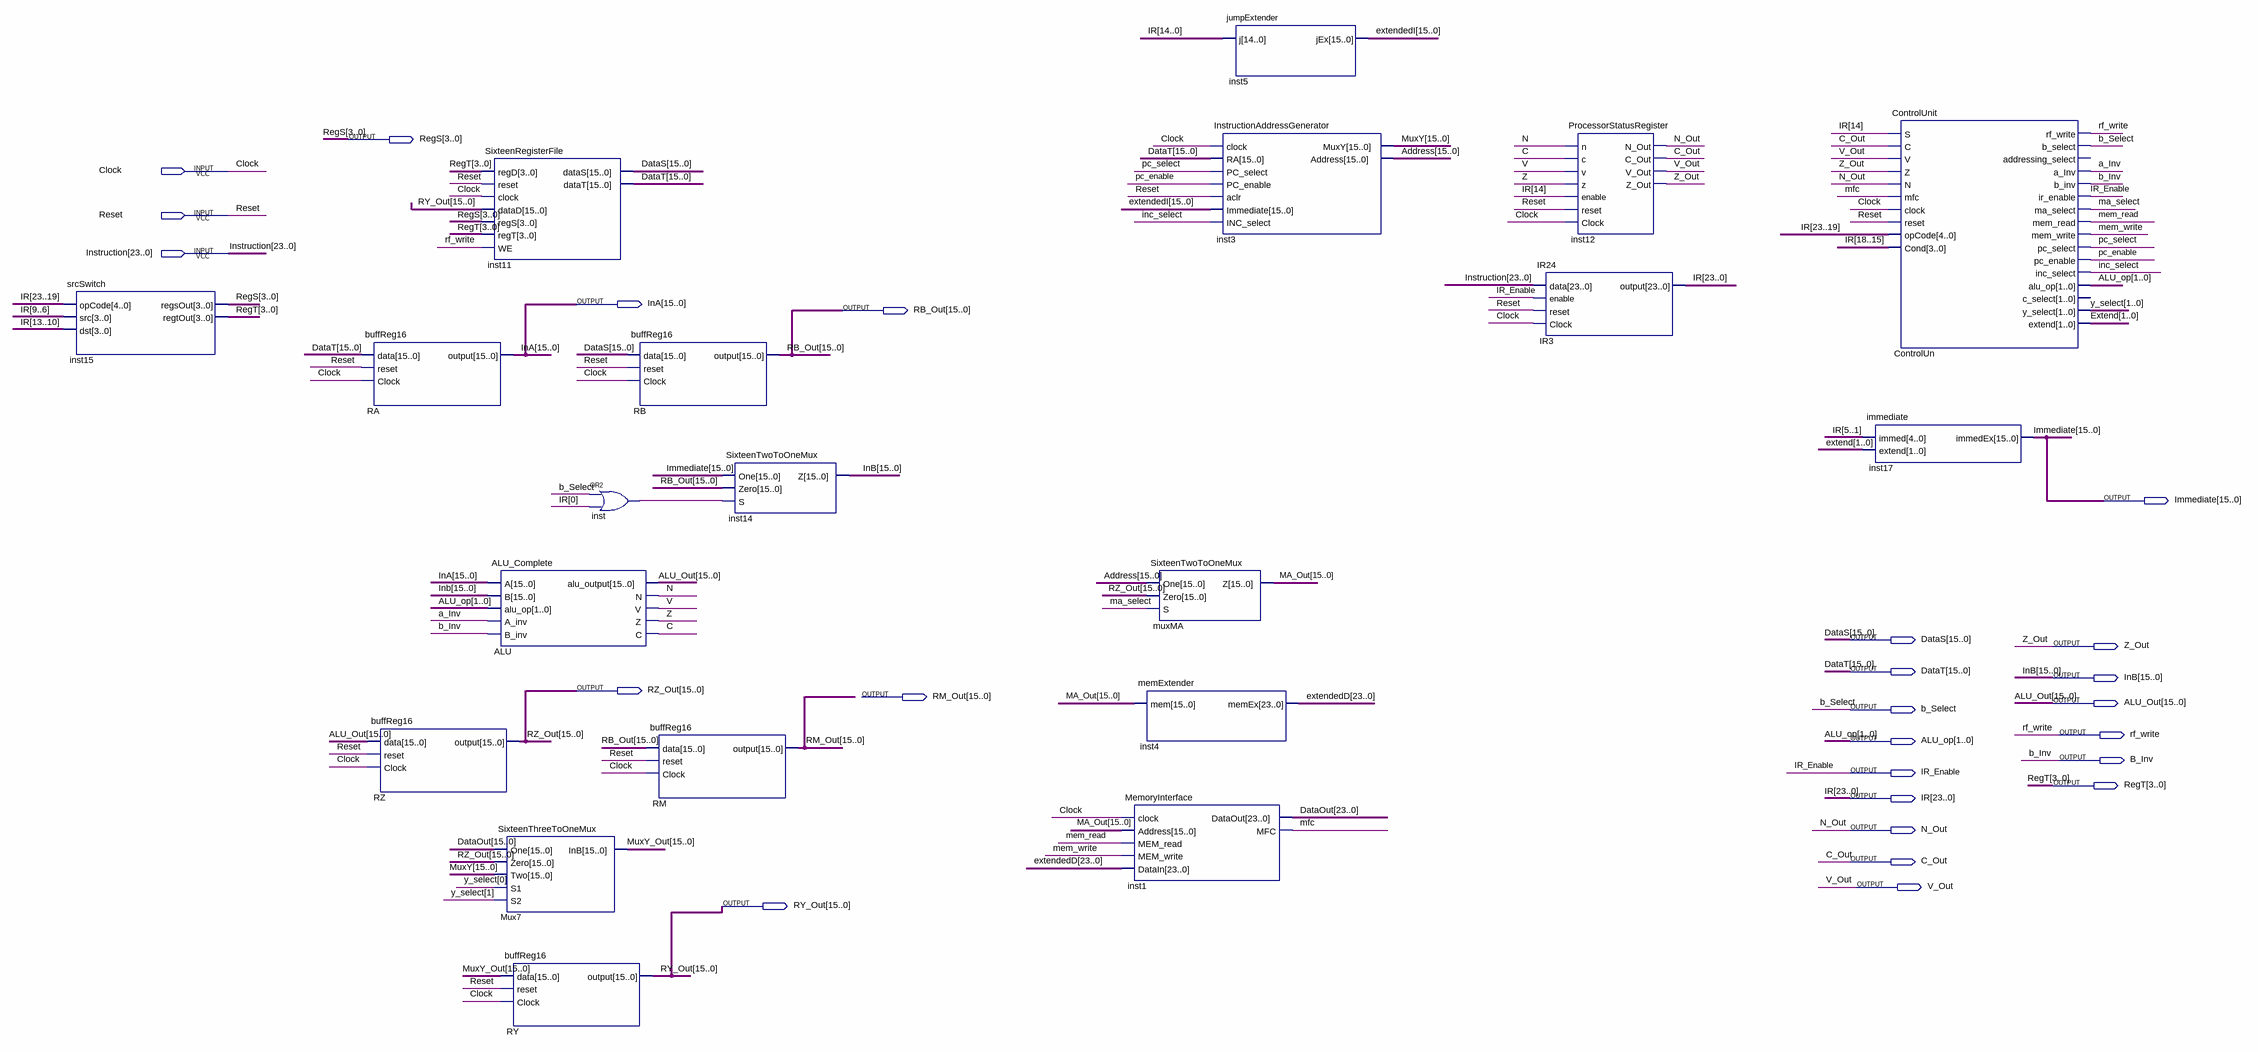
[diagram p0: schematic sheet]
// Quartus schematic Processor.bdf as structural Verilog: 20 symbols, 25 pins
module Processor (
  input  Clock,
  input  Reset,
  input  [23:0] Instruction,
  output [3:0] RegS,
  output [15:0] InA,
  output [15:0] RB_Out,
  output [15:0] Immediate,
  output [15:0] DataS,
  output Z_Out,
  output [15:0] DataT,
  output [15:0] InB,
  output [15:0] RZ_Out,
  output [15:0] RM_Out,
  output [15:0] ALU_Out,
  output b_Select,
  output rf_write,
  output [1:0] ALU_op,
  output B_Inv,
  output IR_Enable,
  output [3:0] RegT,
  output [23:0] IR,
  output N_Out,
  output C_Out,
  output V_Out,
  output [15:0] RY_Out
);

  wire a_Inv, C, inc_select, inst_out, ma_select, mem_read, mem_write, mfc, N, pc_enable, pc_select, V, Z;
  wire [1:0] Extend, y_select;
  wire [15:0] Address, extendedI, MA_Out, MuxY, MuxY_Out;
  wire [23:0] DataOut, extendedD;

  srcSwitch inst15 (.opCode(IR[23:19]), .src(IR[9:6]), .dst(IR[13:10]), .regsOut(RegS), .regtOut(RegT));
  buffReg16 RA (.data(DataT), .reset(Reset), .Clock(Clock), .\output (InA));
  buffReg16 RZ (.data(ALU_Out), .reset(Reset), .Clock(Clock), .\output (RZ_Out));
  SixteenRegisterFile inst11 (
    .regD(RegT), .reset(Reset), .clock(Clock), .dataD(RY_Out), .regS(RegS), .regT(RegT), .WE(rf_write),
    .dataS(DataS), .dataT(DataT));
  ALU_Complete ALU (
    .A(InA), .B(InB), .alu_op(ALU_op), .A_inv(a_Inv), .B_inv(B_Inv), .alu_output(ALU_Out), .N(N), .V(V),
    .Z(Z), .C(C));
  SixteenThreeToOneMux Mux7 (
    .One(DataOut[15:0]), .Zero(RZ_Out), .Two(MuxY), .S1(y_select[0]), .S2(y_select[1]), .InB(MuxY_Out));
  buffReg16 RY (.data(MuxY_Out), .reset(Reset), .Clock(Clock), .\output (RY_Out));
  or inst (inst_out, b_Select, IR[0]);
  buffReg16 RB (.data(DataS), .reset(Reset), .Clock(Clock), .\output (RB_Out));
  buffReg16 RM (.data(RB_Out), .reset(Reset), .Clock(Clock), .\output (RM_Out));
  SixteenTwoToOneMux inst14 (.One(Immediate), .Zero(RB_Out), .S(inst_out), .Z(InB));
  MemoryInterface inst1 (
    .clock(Clock), .Address(MA_Out), .MEM_read(mem_read), .MEM_write(mem_write), .DataIn(extendedD),
    .DataOut(DataOut), .MFC(mfc));
  SixteenTwoToOneMux muxMA (.One(Address), .Zero(RZ_Out), .S(ma_select), .Z(MA_Out));
  memExtender inst4 (.mem(MA_Out), .memEx(extendedD));
  jumpExtender inst5 (.j(IR[14:0]), .jEx(extendedI));
  InstructionAddressGenerator inst3 (
    .clock(Clock), .RA(DataT), .PC_select(pc_select), .PC_enable(pc_enable), .aclr(Reset),
    .Immediate(extendedI), .INC_select(inc_select), .MuxY(MuxY), .Address(Address));
  ProcessorStatusRegister inst12 (
    .n(N), .c(C), .v(V), .z(Z), .enable(IR[14]), .reset(Reset), .Clock(Clock), .N_Out(N_Out), .C_Out(C_Out),
    .V_Out(V_Out), .Z_Out(Z_Out));
  IR24 IR3 (.data(Instruction), .enable(IR_Enable), .reset(Reset), .Clock(Clock), .\output (IR));
  immediate inst17 (.immed(IR[5:1]), .extend(Extend), .immedEx(Immediate));
  ControlUnit ControlUn (
    .S(IR[14]), .C(C_Out), .V(V_Out), .Z(Z_Out), .N(N_Out), .mfc(mfc), .clock(Clock), .reset(Reset),
    .opCode(IR[23:19]), .Cond(IR[18:15]), .rf_write(rf_write), .b_select(b_Select), .a_Inv(a_Inv),
    .b_inv(B_Inv), .ir_enable(IR_Enable), .ma_select(ma_select), .mem_read(mem_read), .mem_write(mem_write),
    .pc_select(pc_select), .pc_enable(pc_enable), .inc_select(inc_select), .alu_op(ALU_op),
    .y_select(y_select), .extend(Extend));  // open: addressing_select, c_select
endmodule
